# Altium schematic sheet Top.SchDoc
size A4
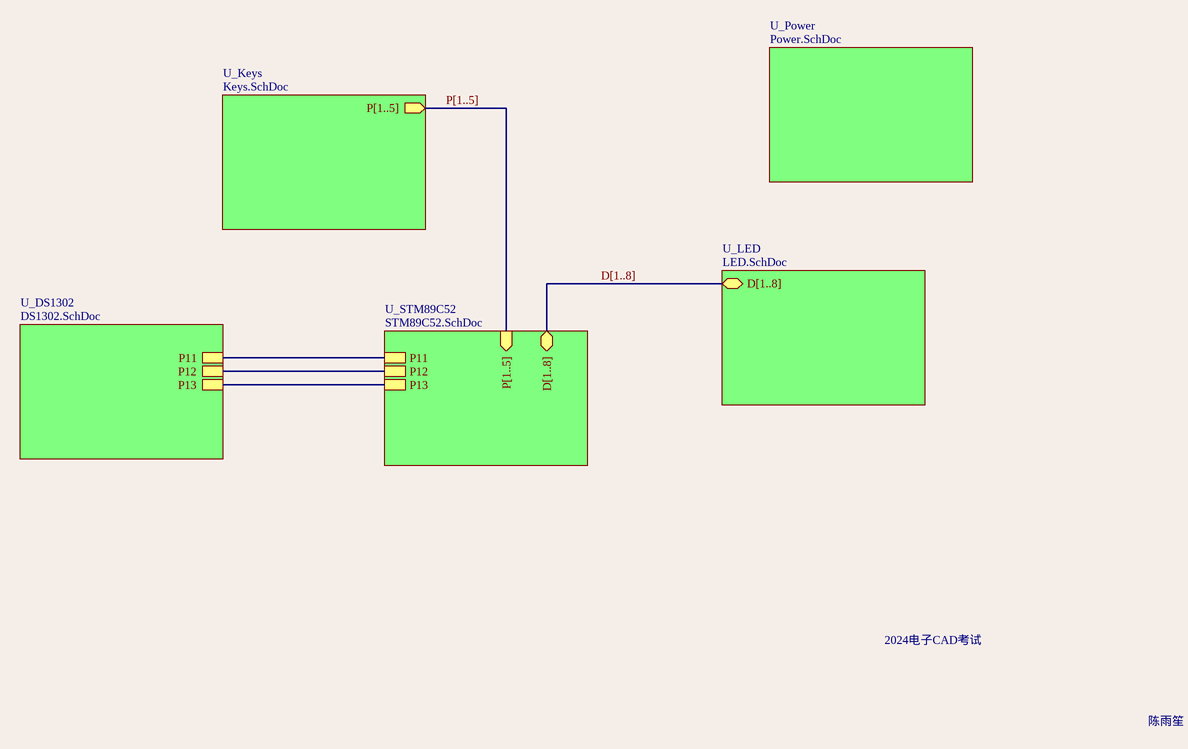
[diagram p0: Top.SchDoc]

## Sub-sheets
U_DS1302 = DS1302.SchDoc: P11, P12, P13
U_Keys = Keys.SchDoc: P[1..5] (out)
U_LED = LED.SchDoc: D[1..8] (bidir)
U_Power = Power.SchDoc: no entries
U_STM89C52 = STM89C52.SchDoc: D[1..8] (bidir), P11, P12, P13, P[1..5] (in)

## Nets
(unnamed): sheet U_STM89C52/P11, sheet U_DS1302/P11
(unnamed): sheet U_STM89C52/P12, sheet U_DS1302/P12
(unnamed): sheet U_STM89C52/P13, sheet U_DS1302/P13

## Buses and harness runs
bus D[1..8] = sheet U_LED/D[1..8] = sheet U_STM89C52/D[1..8]
bus P[1..5] = sheet U_Keys/P[1..5] = sheet U_STM89C52/P[1..5]

## Notes on the sheet
- 2024电子CAD考试
- 陈雨笙